# Altium schematic sheet AUDIO.SchDoc
size A4; SheetNumber: 6; SheetTotal: 6
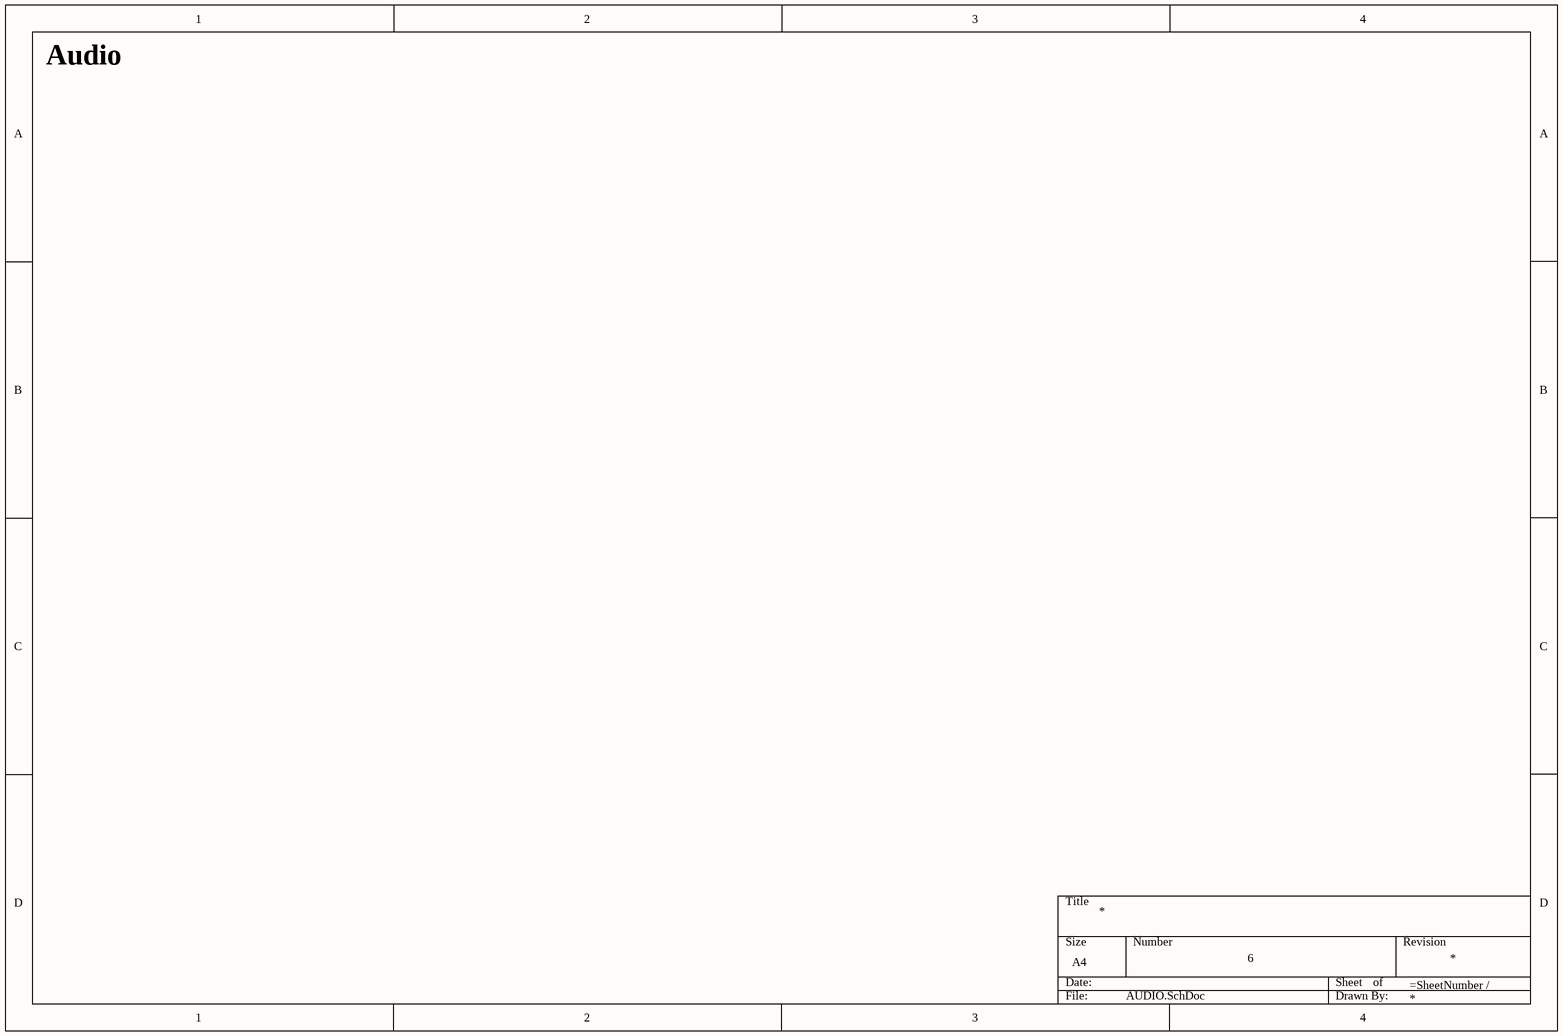
[diagram p0: AUDIO.SchDoc]

## Notes on the sheet
- Audio